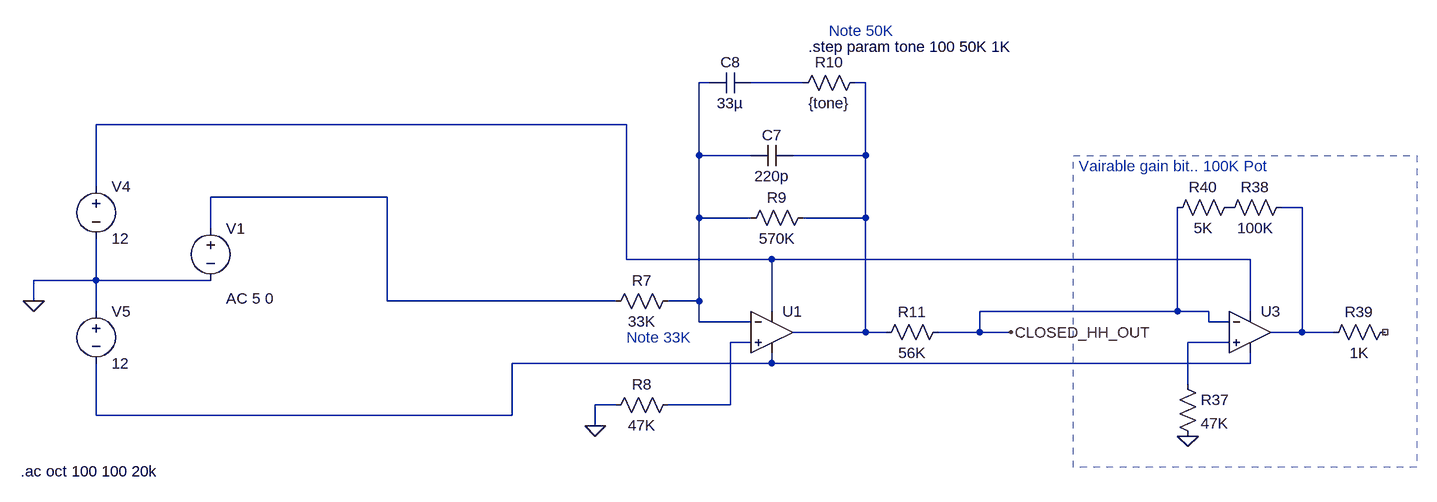
[diagram p0: schematic filter_bit.asc]
filter_bit.asc, the LTspice schematic file:
Version 4
SHEET 1 2500 1120
WIRE 1408 -64 1392 -64
WIRE 1552 -64 1472 -64
WIRE 1648 -64 1632 -64
WIRE 1280 0 464 0
WIRE 1392 48 1392 -64
WIRE 1472 48 1392 48
WIRE 1648 48 1648 -64
WIRE 1648 48 1536 48
WIRE 464 96 464 0
WIRE 912 112 640 112
WIRE 2320 128 2288 128
WIRE 1392 144 1392 48
WIRE 1472 144 1392 144
WIRE 1648 144 1648 48
WIRE 1648 144 1552 144
WIRE 640 160 640 112
WIRE 1280 208 1280 0
WIRE 1504 208 1280 208
WIRE 2240 208 1504 208
WIRE 464 240 464 176
WIRE 464 240 368 240
WIRE 640 240 464 240
WIRE 368 272 368 240
WIRE 912 272 912 112
WIRE 1264 272 912 272
WIRE 1392 272 1392 144
WIRE 1392 272 1344 272
WIRE 464 288 464 240
WIRE 1504 288 1504 208
WIRE 2128 288 2128 128
WIRE 2128 288 1824 288
WIRE 2176 288 2128 288
WIRE 2240 288 2240 208
WIRE 1392 304 1392 272
WIRE 1472 304 1392 304
WIRE 2176 304 2176 288
WIRE 2208 304 2176 304
WIRE 1648 320 1648 144
WIRE 1648 320 1536 320
WIRE 1680 320 1648 320
WIRE 1824 320 1824 288
WIRE 1824 320 1760 320
WIRE 1872 320 1824 320
WIRE 2320 320 2320 128
WIRE 2320 320 2272 320
WIRE 2368 320 2320 320
WIRE 1472 336 1440 336
WIRE 2208 336 2144 336
WIRE 1504 368 1504 352
WIRE 1504 368 1104 368
WIRE 2240 368 2240 352
WIRE 2240 368 1504 368
WIRE 2144 400 2144 336
WIRE 1264 432 1232 432
WIRE 1440 432 1440 336
WIRE 1440 432 1344 432
WIRE 464 448 464 368
WIRE 1104 448 1104 368
WIRE 1104 448 464 448
WIRE 1232 464 1232 432
FLAG 1232 464 0
FLAG 1872 320 CLOSED_HH_OUT
FLAG 2144 480 0
FLAG 368 272 0
SYMBOL res 1360 256 R90
WINDOW 0 0 56 VBottom 2
WINDOW 3 32 56 VTop 2
SYMATTR InstName R7
SYMATTR Value 33K
SYMBOL res 1360 416 R90
WINDOW 0 0 56 VBottom 2
WINDOW 3 32 56 VTop 2
SYMATTR InstName R8
SYMATTR Value 47K
SYMBOL res 1568 128 R90
WINDOW 0 0 56 VBottom 2
WINDOW 3 32 56 VTop 2
SYMATTR InstName R9
SYMATTR Value 570K
SYMBOL cap 1536 32 R90
WINDOW 0 0 32 VBottom 2
WINDOW 3 32 32 VTop 2
SYMATTR InstName C7
SYMATTR Value 220p
SYMBOL cap 1472 -80 R90
WINDOW 0 0 32 VBottom 2
WINDOW 3 32 32 VTop 2
SYMATTR InstName C8
SYMATTR Value 33µ
SYMBOL res 1648 -80 R90
WINDOW 0 0 56 VBottom 2
WINDOW 3 32 56 VTop 2
SYMATTR InstName R10
SYMATTR Value {tone}
SYMBOL OpAmps\\UniversalOpamp 1504 320 R0
SYMATTR InstName U1
SYMBOL res 1776 304 R90
WINDOW 0 0 56 VBottom 2
WINDOW 3 32 56 VTop 2
SYMATTR InstName R11
SYMATTR Value 56K
SYMBOL OpAmps\\UniversalOpamp 2240 320 R0
SYMATTR InstName U3
SYMBOL res 2128 384 R0
SYMATTR InstName R37
SYMATTR Value 47K
SYMBOL res 2304 112 R90
WINDOW 0 0 56 VBottom 2
WINDOW 3 32 56 VTop 2
SYMATTR InstName R38
SYMATTR Value 100K
SYMBOL res 2464 304 R90
WINDOW 0 0 56 VBottom 2
WINDOW 3 32 56 VTop 2
SYMATTR InstName R39
SYMATTR Value 1K
SYMBOL res 2224 112 R90
WINDOW 0 0 56 VBottom 2
WINDOW 3 32 56 VTop 2
SYMATTR InstName R40
SYMATTR Value 5K
SYMBOL voltage 464 80 R0
WINDOW 123 0 0 Left 0
WINDOW 39 0 0 Left 0
SYMATTR InstName V4
SYMATTR Value 12
SYMBOL voltage 464 272 R0
WINDOW 123 0 0 Left 0
WINDOW 39 0 0 Left 0
SYMATTR InstName V5
SYMATTR Value 12
SYMBOL voltage 640 144 R0
WINDOW 123 24 124 Left 2
WINDOW 39 0 0 Left 0
SYMATTR InstName V1
SYMATTR Value ""
SYMATTR Value2 AC 5 0
TEXT 1592 -144 Left 2 ;Note 50K
TEXT 1280 328 Left 2 ;Note 33K
TEXT 1976 64 Left 2 ;Vairable gain bit.. 100K Pot
TEXT 348 534 Left 2 !.ac oct 100 100 20k
TEXT 1560 -120 Left 2 !.step param tone 100 50K 1K
RECTANGLE Normal 2496 528 1968 48 2

The netlist it stands for:
* filter_bit.asc
R7 N001 N005 33K
R8 N007 0 47K
R9 N003 N001 570K
C7 N003 N001 220p
C8 N002 N001 33µ
R10 N003 N002 {tone}
XU1 N007 N001 N004 N009 N003 level1 Avol=1Meg GBW=10Meg Vos=0 En=0 Enk=0 In=0 Ink=0 Rin=500Meg  ; pins In+ In- V+ V- OUT
R11 CLOSED_HH_OUT N003 56K
XU3 N008 CLOSED_HH_OUT N004 N009 N006 level1 Avol=1Meg GBW=10Meg Vos=0 En=0 Enk=0 In=0 Ink=0 Rin=500Meg  ; pins In+ In- V+ V- OUT
R37 N008 0 47K
R38 N006 P001 100K
R39 NC_01 N006 1K
R40 P001 CLOSED_HH_OUT 5K
V4 N004 0 12
V5 0 N009 12
V1 N005 0 AC 5 0
* Note 50K
* Note 33K
* Vairable gain bit.. 100K Pot
.ac oct 100 100 20k
.step param tone 100 50K 1K
.lib UniversalOpAmp1.lib
.backanno
.end